# Altium project NewBrightCo_2015_Corvette.PrjPcb
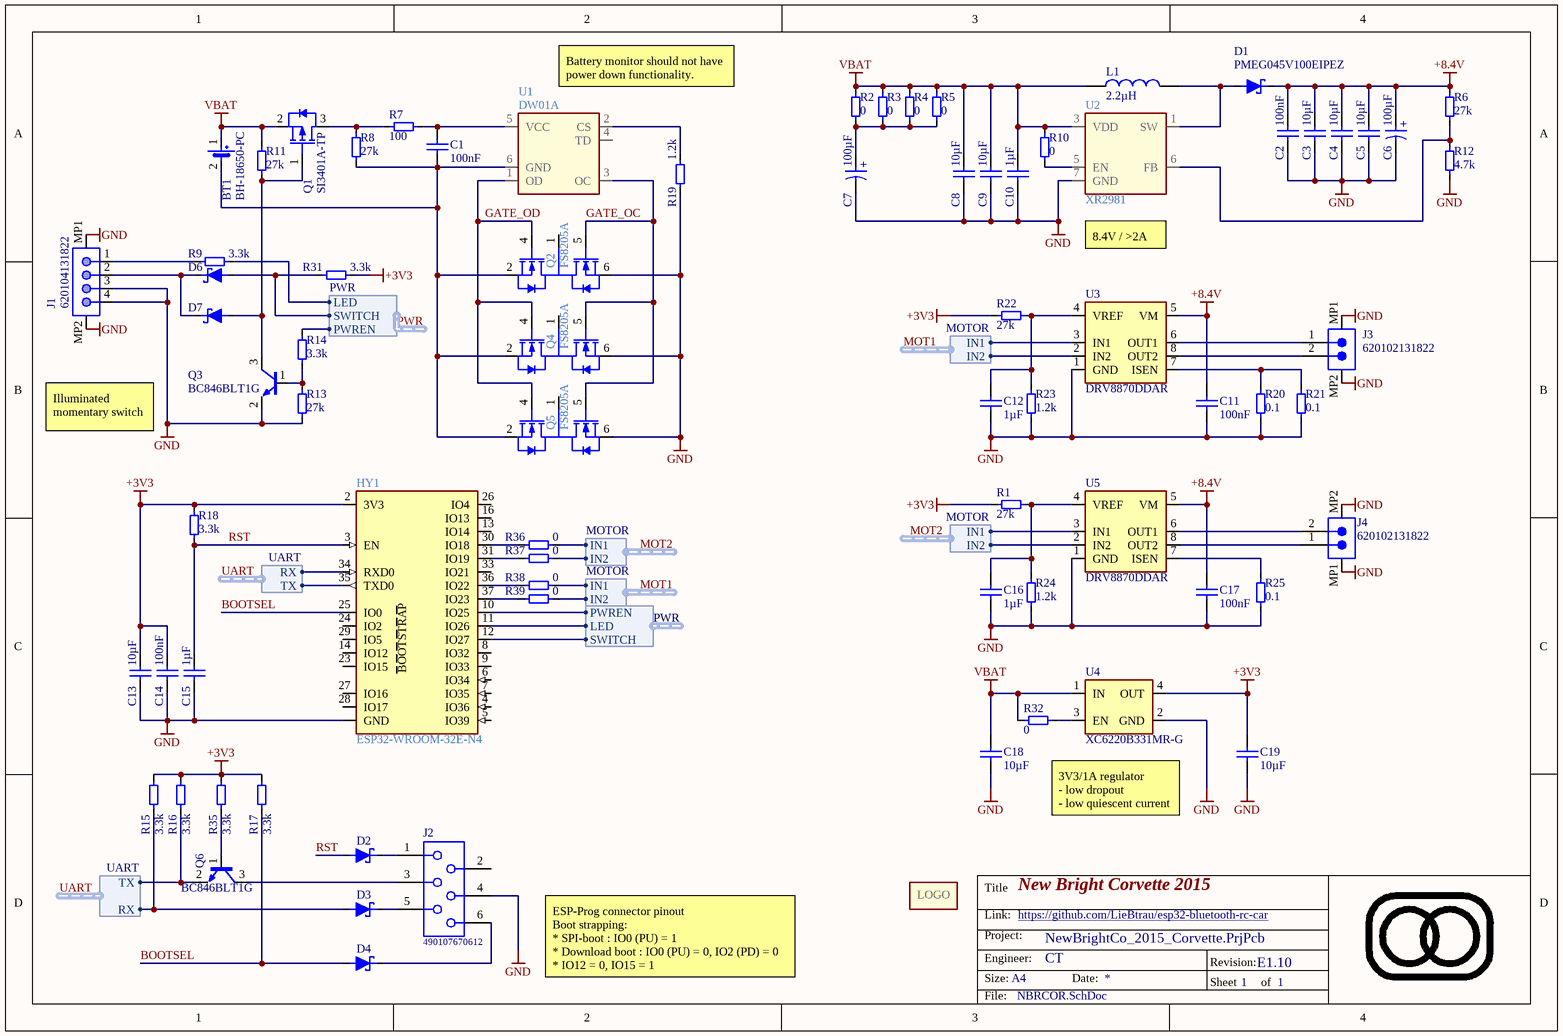
[diagram p0: NBRCOR.SchDoc]
board_name: NBRCOR; Project_link: https://github.com/LieBtrau/esp32-bluetooth-rc-car; project_revision: E1.10
1 sheet, 76 parts. Net scope: global (net labels, ports and power ports of the same name join across sheets).
Board file: NBRCOR.PcbDoc

## Sheet NBRCOR.SchDoc: New Bright Corvette 2015
size A4; Engineer: CT; SheetNumber: 1; SheetTotal: 1; SPICEModelCacheMNSAWVXE: <root> / <DocumentId>MNSAWVXE</DocumentId> / <CacheFrame Number="0"> / <Model Name="1090_7443330220_2.2u" Kind="CKT"> / <Text>******* / .subckt 1090_7443330220_2.2u 1 2 / Rp 1 2 1784 / Cp 1 2 1.727p / Rs 1 N3 0.0046 / L1 N3 2 1.945u / .ends 1090_7443330220_2.2u</Text> / </Model> / </CacheFrame> / </root>

### Parts
BT1  BH-18650-PC  [BH-18650-PC-Footprint-1]
C1  value 100nF  [0603-C-L]  (hidden comment: Capacitor 100nF +/-10% 25V X7R 0603)
C2  value 100nF  [0603-C-L]  (hidden comment: Capacitor 100nF +/-10% 25V X7R 0603)
C3  value 10µF  [0805-C-N]  (hidden comment: Capacitor 10µF +/-10% 10V X7R 0805)
C4  value 10µF  [0805-C-N]  (hidden comment: Capacitor 10µF +/-10% 10V X7R 0805)
C5  value 10µF  [0805-C-N]  (hidden comment: Capacitor 10µF +/-10% 10V X7R 0805)
C6  Capacitance: 100µF  [WCAP-PTG5_D8H11.5]  (hidden comment: 870025374001)
C7  Capacitance: 100µF  [WCAP-PTG5_D8H11.5]  (hidden comment: 870025374001)
C8  value 10µF  [0805-C-N]  (hidden comment: Capacitor 10µF +/-10% 10V X7R 0805)
C9  value 10µF  [0805-C-N]  (hidden comment: Capacitor 10µF +/-10% 10V X7R 0805)
C10  value 1µF  [0805-C-N]  (hidden comment: Capacitor 1µF +/-10% 10V X7R 0805)
C11  value 100nF  [0603-C-L]  (hidden comment: Capacitor 100nF +/-10% 25V X7R 0603)
C12  value 1µF  [0805-C-N]  (hidden comment: Capacitor 1µF +/-10% 10V X7R 0805)
C13  value 10µF  [0805-C-N]  (hidden comment: Capacitor 10µF +/-10% 10V X7R 0805)
C14  value 100nF  [0603-C-L]  (hidden comment: Capacitor 100nF +/-10% 25V X7R 0603)
C15  value 1µF  [0805-C-N]  (hidden comment: Capacitor 1µF +/-10% 10V X7R 0805)
C16  value 1µF  [0805-C-N]  (hidden comment: Capacitor 1µF +/-10% 10V X7R 0805)
C17  value 100nF  [0603-C-L]  (hidden comment: Capacitor 100nF +/-10% 25V X7R 0603)
C18  value 10µF  [0805-C-N]  (hidden comment: Capacitor 10µF +/-10% 10V X7R 0805)
C19  value 10µF  [0805-C-N]  (hidden comment: Capacitor 10µF +/-10% 10V X7R 0805)
D1  PMEG045V100EIPEZ  [TO-277]
D2  1PS79SB30,115  [FP-SOD523-MFG]  (value not drawn)
D3  1PS79SB30,115  [FP-SOD523-MFG]  (value not drawn)
D4  1PS79SB30,115  [FP-SOD523-MFG]  (value not drawn)
D6  1PS79SB30,115  [FP-SOD523-MFG]  (value not drawn)
D7  1PS79SB30,115  [FP-SOD523-MFG]  (value not drawn)
HY1  ESP32-WROOM-32E-N4  [FP-ESP32-WROOM-32E_4MB-MFG]
J1  620104131822  [620104131822]
J2  490107670612  [490107670612_Debugging Application]  (no BOM)
J3  620102131822  [620102131822]
J4  620102131822  [620102131822]
L1  Inductance: 2.2µH  [WE-HCC_1090]  (hidden comment: 7443330220)
M1  Logo  [LOGO_9x6mm]  (value not drawn)  (no BOM)
Q1  SI3401A-TP  [SOT-23-3-N]
Q2  FS8205A  [TSSOP8]
Q3  BC846BLT1G  [SOT-23-3-N]
Q4  FS8205A  [TSSOP8]
Q5  FS8205A  [TSSOP8]
Q6  BC846BLT1G  [SOT-23-3-N]
R1  value 27k  [0603-R-N]  (hidden comment: Resistor 27K +/-1% 0.1W 0603)
R2  value 0  [0603-R-N]  (hidden comment: Jumper 0R <50 mOhm 1A 0603)
R3  value 0  [0603-R-N]  (hidden comment: Jumper 0R <50 mOhm 1A 0603)
R4  value 0  [0603-R-N]  (hidden comment: Jumper 0R <50 mOhm 1A 0603)
R5  value 0  [0603-R-N]  (hidden comment: Jumper 0R <50 mOhm 1A 0603)
R6  value 27k  [0603-R-N]  (hidden comment: Resistor 27K +/-1% 0.1W 0603)
R7  value 100  [0603-R-N]  (hidden comment: Resistor 100R +/-1% 50V 0603)
R8  value 27k  [0603-R-N]  (hidden comment: Resistor 27K +/-1% 0.1W 0603)
R9  value 3.3k  [0603-R-N]  (hidden comment: Resistor 3.3k +/-1% 50V 0603)
R10  value 0  [0603-R-N]  (hidden comment: Jumper 0R <50 mOhm 1A 0603)
R11  value 27k  [0603-R-N]  (hidden comment: Resistor 27K +/-1% 0.1W 0603)
R12  value 4.7k  [0603-R-N]  (hidden comment: Resistor 4.7k +/-1% 50V 0603)
R13  value 27k  [0603-R-N]  (hidden comment: Resistor 27K +/-1% 0.1W 0603)
R14  value 3.3k  [0603-R-N]  (hidden comment: Resistor 3.3k +/-1% 50V 0603)
R15  value 3.3k  [0603-R-N]  (hidden comment: Resistor 3.3k +/-1% 50V 0603)
R16  value 3.3k  [0603-R-N]  (hidden comment: Resistor 3.3k +/-1% 50V 0603)
R17  value 3.3k  [0603-R-N]  (hidden comment: Resistor 3.3k +/-1% 50V 0603)
R18  value 3.3k  [0603-R-N]  (hidden comment: Resistor 3.3k +/-1% 50V 0603)
R19  value 1.2k  [0603-R-N]  (hidden comment: Resistor 1.2k +/-1% 50V 0603)
R20  value 0.1  [1206-R-N]  (hidden comment: CSR1206FKR100)
R21  value 0.1  [1206-R-N]  (hidden comment: CSR1206FKR100)
R22  value 27k  [0603-R-N]  (hidden comment: Resistor 27K +/-1% 0.1W 0603)
R23  value 1.2k  [0603-R-N]  (hidden comment: Resistor 1.2k +/-1% 50V 0603)
R24  value 1.2k  [0603-R-N]  (hidden comment: Resistor 1.2k +/-1% 50V 0603)
R25  value 0.1  [1206-R-N]  (hidden comment: CSR1206FKR100)
R31  value 3.3k  [0603-R-N]  (hidden comment: Resistor 3.3k +/-1% 50V 0603)
R32  value 0  [0603-R-N]  (hidden comment: Jumper 0R <50 mOhm 1A 0603)
R35  value 3.3k  [0603-R-N]  (hidden comment: Resistor 3.3k +/-1% 50V 0603)
R36  value 0  [0603-R-N]  (hidden comment: Jumper 0R <50 mOhm 1A 0603)
R37  value 0  [0603-R-N]  (hidden comment: Jumper 0R <50 mOhm 1A 0603)
R38  value 0  [0603-R-N]  (hidden comment: Jumper 0R <50 mOhm 1A 0603)
R39  value 0  [0603-R-N]  (hidden comment: Jumper 0R <50 mOhm 1A 0603)
U1  DW01A  [SOT-23-6]
U2  XR2981  [SOIC8_N_EP]
U3  DRV8870DDAR  [SOIC8_N_EP]
U4  XC6220B331MR-G  [SOT25-N]
U5  DRV8870DDAR  [SOIC8_N_EP]

### Harnesses
UART: RX, TX
MOTOR: IN1, IN2
PWR: LED, SWITCH, PWREN

### Nets
+3V3: C13.2 C14.2 C19.1 HY1.2(3V3) R1.2 R15.2 R16.2 R17.2 R18.2 R22.2 R31.1 R35.2 U4.4(OUT)
+8.4V: C2.1 C3.2 C4.2 C5.2 C6.1(P) C11.2 C17.2 D1.1(K) R6.2 U3.5(VM) U5.5(VM)
GND: C2.2 C3.1 C4.1 C5.1 C6.2(N) C7.2(N) C8.1 C9.1 C10.1 C11.1 C12.2 C13.1 C14.1 C15.1 C16.2 C17.1 C18.2 C19.2 HY1.1(GND) J1.3 J1.4 J1.MP1 J1.MP2 J2.4 J3.MP1 J3.MP2 J4.MP1 J4.MP2 Q2.6(S2) Q3.2(E) Q4.6(S2) Q5.6(S2) R12.1 R13.1 R19.1 R20.1 R21.1 R23.1 R24.1 R25.1 U2.7(GND) U3.1(GND) U4.2(GND) U5.1(GND)
VBAT: BT1.1(+) C8.2 C9.2 C10.2 C18.1 L1.1 Q1.2(SOURCE) R2.2 R3.2 R4.2 R5.2 R10.2 R11.2 R32.1 U2.3(VDD) U4.1(IN)
BOOTSEL: D4.2(A) HY1.25(IO0) R17.1
GATE_OC: Q2.5(G2) Q4.5(G2) Q5.5(G2) U1.3(OC)
GATE_OD: Q2.4(G1) Q4.4(G1) Q5.4(G1) U1.1(OD)
MOT1.IN1: R38.1 U3.3(IN1) ; harness MOTOR.IN1
MOT1.IN2: R39.1 U3.2(IN2) ; harness MOTOR.IN2
MOT2.IN1: R36.1 U5.3(IN1) ; harness MOTOR.IN1
MOT2.IN2: R37.1 U5.2(IN2) ; harness MOTOR.IN2
PWR.LED: HY1.11(IO26) R9.2 ; harness PWR.LED
PWR.PWREN: HY1.10(IO25) R14.2 ; harness PWR.PWREN
PWR.SWITCH: D6.2(A) HY1.12(IO27) R31.2 ; harness PWR.SWITCH
RST: C15.2 D2.2(A) HY1.3(EN) R18.1
UART.RX: D3.2(A) HY1.34(RXD0) R15.1 ; harness UART.RX
UART.TX: HY1.35(TXD0) Q6.2(E) R16.1 ; harness UART.TX
NetBT1_2: BT1.2(-) C1.2 Q2.2(S1) Q4.2(S1) Q5.2(S1) R8.2 U1.6(GND)
NetC1_1: C1.1 R7.2 U1.5(VCC)
NetC7_1: C7.1(P) R2.1 R3.1 R4.1 R5.1
NetC12_1: C12.1 R22.1 R23.2 U3.4(VREF)
NetC16_1: C16.1 R1.1 R24.2 U5.4(VREF)
NetD1_2: D1.2(A) L1.2 U2.1(SW)
NetD2_1: D2.1(K) J2.1
NetD3_1: D3.1(K) J2.5
NetD4_1: D4.1(K) J2.6
NetD6_1: D6.1(K) D7.1(K) J1.2
NetD7_2: D7.2(A) Q1.1(GATE) Q3.3(C) R11.1
NetHY1_30: HY1.30(IO18) R36.2
NetHY1_31: HY1.31(IO19) R37.2
NetHY1_36: HY1.36(IO22) R38.2
NetHY1_37: HY1.37(IO23) R39.2
NetJ1_1: J1.1 R9.1
NetJ2_3: J2.3 Q6.3(C)
NetJ3_1: J3.1 U3.6(OUT1)
NetJ3_2: J3.2 U3.8(OUT2)
NetJ4_1: J4.1 U5.8(OUT2)
NetJ4_2: J4.2 U5.6(OUT1)
NetQ1_3: Q1.3(DRAIN) R7.1 R8.1
NetQ3_1: Q3.1(B) R13.2 R14.1
NetQ6_1: Q6.1(B) R35.1
NetR6_1: R6.1 R12.2 U2.6(FB)
NetR10_1: R10.1 U2.5(EN)
NetR19_2: R19.2 U1.2(CS)
NetR20_2: R20.2 R21.2 U3.7(ISEN)
NetR25_2: R25.2 U5.7(ISEN)
NetR32_2: R32.2 U4.3(EN)

Not connected (* = marked no-connect by the designer): HY1 4(IO36) 5(IO39) 6(IO34) 7(IO35) 8(IO32) 9(IO33) 13(IO14) 14(IO12) 16(IO13) 23(IO15) 24(IO2) 26(IO4) 27(IO16) 28(IO17) 29(IO5) 33(IO21); J2 2; Q2 1(D12); Q4 1(D12); Q5 1(D12); U1 4(TD)

### Notes on the sheet
- (near U1) Battery monitor should not have power down functionality.
- (near U2) 8.4V / >2A
- Illuminated momentary switch
- 3V3/1A regulator
  - low dropout
  - low quiescent current
- ESP-Prog connector pinout
  Boot strapping:
  * SPI-boot : IO0 (PU) = 1
  * Download boot : IO0 (PU) = 0, IO2 (PD) = 0
  * IO12 = 0, IO15 = 1
- Title
- Link:
- Size:
- Project:
- Engineer:
- A4
- Date:
- Revision:
- Sheet
- of
- File:
- (in symbol CMP-00003-5) BOOTSTRAP
- (in symbol CMP-098-000013-3) +
- (in symbol Logo) LOGO

### Library data of the parts
BT1 = CMP-001-0034-6: Battery Holder 18650 Pc Pin; Number of Cells: 1; Termination: PC Pin; Min Operating Temperature: -40°C; Series: -; RoHS Compliant: Yes; Max Operating Temperature: 180°C; Mounting Technology: Through Hole,PCB; ComponentLink1Description: AliExpress alternative source; ComponentLink1URL: https://www.aliexpress.com/item/33037738446.html; JLCPCB Part #: C5383220
C1 C2 C11 C14 C17 = CMP-072-000592-12: WCAP-CSGP Multilayer Ceramic Chip Capacitor, General Purpose, size 0603, X7R, 100nF, 25VDC; Capacitor Type: MLCC; Tolerance: 10%; Dissipation Factor: 3.5%; Technical Reference: X7R0603104K025DFCT10000; Insulation Resistance: 5GO; Length: 1.6mm; Dielectric: X7R; Height: 0.8mm; Pins: 2; Min Operating Temperature: -55°C; Usage: General Purpose; Mounting Technology: SMT; Case/Package: 0603; Width: 0.8mm; Max Operating Temperature: 125°C; Voltage Rating: 25V; Design Item ID: 885012206071; ComponentLink1URL: https://www.we-online.com/redexpert/article/885012206071?ad; ComponentLink2URL: https://www.we-online.com/redexpert/spec/885012206071?ad; Packaging: Tape and Reel; ComponentLink1Description: Website Link; Match Code: WCAP-CSGP; ComponentLink2Description: Datasheet Link; Source: WCAP-CSGP.SchLib; JLCPCB Part #: C14663
C3-C5 C8 C9 C13 C18 C19 = CMP-072-000663-12: WCAP-CSGP Multilayer Ceramic Chip Capacitor, General Purpose, size 0805, X7R, 10µF, 10VDC; Technical Reference: X7R0805106K010DFCT10000; Tolerance: 10%; Capacitor Type: MLCC; Insulation Resistance: 0.01GO; Length: 2mm; ComponentLink2URL: https://www.we-online.com/redexpert/spec/885012207026?ad; Packaging: Tape and Reel; ComponentLink1Description: Website Link; Design Item ID: 885012207026; Source: WCAP-CSGP.SchLib; ComponentLink2Description: Datasheet Link; Pins: 2; Usage: General Purpose; Voltage Rating: 10V; Height: 1.25mm; ComponentLink1URL: https://www.we-online.com/redexpert/article/885012207026?ad; Dielectric: X7R; Mounting Technology: SMT; Dissipation Factor: 10%; Min Operating Temperature: -55°C; Width: 1.25mm; Max Operating Temperature: 125°C; Case/Package: 0805; Match Code: WCAP-CSGP; JLCPCB Part #: C15850
C6 C7 = CMP-098-000013-3: WCAP-PTG5 Aluminum Polymer Capacitor, Radial THT, D8 x H11.5mm, 100µF, 16V; Manufacturer: Wurth Elektronik; Leakage Current: 160µA; Capacitance Tolerance: +/-20%; Dissipation Factor: 8%; ESR: 12mO; Ripple Current: 4800mA; Technical Reference: PTEE115101M016DSPA7B000; Endurance: 2000h; ComponentLink1URL: https://www.we-online.com/redexpert/article/870025374001?ad; ComponentLink2URL: https://www.we-online.com/redexpert/spec/870025374001?ad; Mount: Through Hole; Height: 11.5mm; Diameter: 8mm; Pin Count: 2; Manufacturer Part Number: 870025374001; ComponentLink1Description: Website Link; Design Item ID: 870025374001; Operating Temperature Min: -55°C; Packaging: Ammo Pack; Component Type: Standard; Rated Voltage (DC): 16V; Operating Temperature Max: 105°C; Match Code: WCAP-PTG5; Category: Aluminum Polymer Capacitors; ComponentLink2Description: Datasheet Link; Source: WCAP-PTG5.SchLib
C10 C12 C15 C16 = CMP-072-000659-13: WCAP-CSGP Multilayer Ceramic Chip Capacitor, General Purpose, size 0805, X7R, 1µF, 10VDC; Dissipation Factor: 5%; Technical Reference: X7R0805105K010DFCT10000; Tolerance: 10%; Capacitor Type: MLCC; Insulation Resistance: 0.5GO; Source: WCAP-CSGP.SchLib; Usage: General Purpose; JLCPCB Part #: C28323; Width: 1.25mm; Mounting Technology: SMT; ComponentLink1URL: https://www.we-online.com/redexpert/article/885012207022?ad; Max Operating Temperature: 125°C; ComponentLink2Description: Datasheet Link; Min Operating Temperature: -55°C; Match Code: WCAP-CSGP; Case/Package: 0805; ComponentLink2URL: https://www.we-online.com/redexpert/spec/885012207022?ad; Voltage Rating: 10V; ComponentLink1Description: Website Link; Length: 2mm; Height: 1.25mm; Pins: 2; Dielectric: X7R; Packaging: Tape and Reel; Design Item ID: 885012207022
D1 = CMP-004-00051-4: Schottky Rectifier, 45V, 10A, Sot-1289 Rohs Compliant: Yes; Forward Voltage: 540 mV @ 10 A; Forward Current: 10A; Case/Package: TO-277, 3-PowerFDN, SOT1289B; Max Reverse Voltage (DC): 45V; JLCPCB Part #: C552777
D2-D4 D6 D7 = CMP-004-00048-5: VR=40V IF=200mA 20pF; Forward Voltage: 600 mV @ 200 mA; Forward Current: 200mA; Max Repetitive Reverse Voltage (Vrrm): 40V; Case/Package: SOD-523; RoHS Compliant: Yes; JLCPCB Part #: C426690
HY1 = CMP-00003-5: WiFi-Modul 802.11/BT 2, 4-2, 5GHz 150Mb/s; pin to pad: 1>1+15+38+39.1+39.2+39.3+39.4+39.5+39.6+39.7+39.8+39.9; JLCPCB Part #: C701341
J1 = CMP-047-000042-4: WR-WTB SMT Male Horizontal Shrouded Header, pitch 2mm, 4p; Withstanding Voltage: 800VAC; Contact Resistance: 20mOhm; Pin Number: 4; Working Voltage: 100VAC; Rated Current: 2A; Part Number: 620104131822; Operating Temperature: -25 to +85degC; Publisher: Wurth Elektronik; ComponentLink2URL: https://www.we-online.com/catalog/datasheet/620104131822.pdf; Gender: Male; Published Date: January 2020; Pitch: 2mm; Design Item ID: 620104131822; Component Type: Standard; Pin Count: 4; Type: Horizontal; Packaging: Tape and Reel; ComponentLink1Description: Manufacturer; Source: WR-WTB_2.00mm.SchLib; ComponentLink2Description: Datasheet; Mounting Technology: SMT; ComponentLink1URL: http://www.we-online.de; JLCPCB Part #: C265102
J2 = CMP-002-000028-7: WR-WST REDFIT IDC SKEDD, pitch 2.54mm, 6pins; Contact Resistance max.: 10mOhm; Gender: Transition; Rated Current: 1A; Pin Number: 6; Working Voltage: 100V(AC); Connector Type: Cable,IDC; Design Item ID: 490107670612; Source: WR-WST.SchLib; Packaging: Tube; ComponentLink2Description: Datasheet; Part Number: 490107670612; ComponentLink1Description: Manufacturer; Operating Temperature: -25 to +105degC; Pitch: 2.54mm; ComponentLink1URL: http://www.we-online.de; Published Date: November 2019; Mounting Technology: Press-In; Publisher: Wurth Elektronik; ComponentLink2URL: https://katalog.we-online.com/em/datasheet/490107670612.pdf; RoHS Compliant: Yes; Contact Plating: Gold; Series: REDFIT WR-WST
J3 J4 = CMP-047-000040-10: WR-WTB SMT Male Horizontal Shrouded Header, pitch 2mm, 2p; Rated Current: 2A; Withstanding Voltage: 800VAC; Pin Number: 2; Contact Resistance: 20mOhm; Working Voltage: 100VAC; Part Number: 620102131822; Published Date: January 2020; Pitch: 2mm; Component Type: Standard; Publisher: Wurth Elektronik; Operating Temperature: -25 to +85degC; Design Item ID: 620102131822; Pin Count: 2; Source: WR-WTB_2.00mm.SchLib; ComponentLink2URL: https://www.we-online.com/catalog/datasheet/620102131822.pdf; ComponentLink1Description: Manufacturer; ComponentLink2Description: Datasheet; Mounting Technology: SMT; Type: Horizontal; Packaging: Tape and Reel; ComponentLink1URL: http://www.we-online.de; Gender: Male; JLCPCB Part #: C295747
L1 = CMP-102-000031-2: WE-HCC SMT High Current Cube Inductor, size 1090, 2.2µH, 16.5A, 4.8mO; Manufacturer: Wurth Elektronik; Self Resonant Frequency: 80MHz; Case/Size Code: 1090; DC Resistance: 4.6mO; Saturation Current: 25.6A; Rated Inductance: 2.1µH; Material: Ferrite; DC Resistance Max: 4.8mO; Operating Temperature Max: 125°C; Component Type: Standard; Mount: Surface Mount; Height: 9.3mm; ComponentLink2URL: https://www.we-online.com/redexpert/spec/7443330220?ad; Category: Shielded Power Inductors; Pin Count: 2; Width: 10mm; Rated Current: 16.5A; ComponentLink2Description: Datasheet Link; Packaging: Tape and Reel; Operating Temperature Min: -40°C; Design Item ID: 7443330220; Length: 10.9mm; Match Code: WE-HCC; ComponentLink1URL: https://www.we-online.com/redexpert/article/7443330220?ad; Manufacturer Part Number: 7443330220; ComponentLink1Description: Website Link; Source: WE-HCC.SchLib
Q1 = CMP-013-00056-6: Trans Mosfet P-ch 30V 4.2A 3-PIN SOT-23 T/r; Rds On Max: 60mR; Max Power Dissipation: 400mW; Transistor Type: PMOS; Input Capacitance: 1.05nF; Vgs(th) (Max) @ Id: -1.3V @ 250µA; Mounting Technology: Surface Mount; Packaging: Cut Tape; Min Operating Temperature: -55°C; Id - Continuous Drain Current: 4.2A; Max Operating Temperature: 150°C; RoHS Compliant: Yes; Vds Max: 30V; Case/Package: SOT-23-3; JLCPCB Part #: C194253; Series: -
Q2 Q4 Q5 = CMP-013-00060-4: Dual common drain NFET for Li-Ion protection; pin to pad: 1>1+8 2>2+3 6>6+7; JLCPCB Part #: C16052
Q3 Q6 = CMP-013-00048-11: NPN Ic=100mA Vceo=65V hfe=200~450 P=225mW SOT-23; Ic Max: 100mA; Vce Max: 65V; Case/Package: SOT-23-3; Transistor Type: NPN; JLCPCB Part #: C82477
R1 R6 R8 R11 R13 R22 = CMP-009-00275-9: Res Thick Film 0603 27K Ohm 1% 0.1W(1/10W) ±100ppm/C Pad SMD Automotive T/R; Max Power Dissipation: 100mW; Usage: General Purpose; Tolerance: 1%; JLCPCB Part #: C22967; Case/Package: 0603
R2-R5 R10 R32 R36-R39 = CMP-009-00006-21: Chip Jumper, Thick Film, Jumper, 0603, 100mW, 1A, 0 Ohm, <50 mOhm; Elements: 1; Tolerance: 50 mOhm; Voltage Rating: 75V; Pins: 2; Usage: Jumper; Min Operating Temperature: -55°C; RoHS Compliant: True; JLCPCB Part #: C21189; Case/Package: 0603; Max Operating Temperature: 155°C; Resistor Type: Thick Film; Power Rating: 100mW; Mounting Technology: SMT; Current Rating: 1A
R7 = CMP-009-00232-13: Chip Resistor, Thick Film, General Purpose, 0603, 63mW, 50V, 100 Ohm, +/-1%; Temperature Coefficient: 100ppm/°C; Tolerance: 1%; Elements: 1; Resistor Type: Thick Film; Usage: General Purpose; Min Operating Temperature: -55°C; Max Operating Temperature: 155°C; JLCPCB Part #: C22775; Mounting Technology: SMT; RoHS Compliant: Yes; Power Rating: 63mW; Voltage Rating: 50V; Pins: 2; Case/Package: 0603
R9 R14-R18 R31 R35 = CMP-009-00243-13: Chip Resistor, Thick Film, General Purpose, 0603, 100mW, 50V, 3.3 kOhm, +/-1%; Tolerance: 1%; Elements: 1; Resistor Type: Thick Film; RoHS Compliant: Yes; Voltage Rating: 50V; Usage: General Purpose; Case/Package: 0603; Pins: 2; Power Rating: 100mW; Mounting Technology: SMT; Min Operating Temperature: -55°C; JLCPCB Part #: C22978; Max Operating Temperature: 155°C
R12 = CMP-009-00031-22: Chip Resistor, Thick Film, General Purpose, 0603, 100mW, 50V, 4.7 kOhm, +/-1%; Tolerance: 1%; Elements: 1; Power Rating: 100mW; JLCPCB Part #: C23162; RoHS Compliant: True; Max Operating Temperature: 155°C; Case/Package: 0603; Min Operating Temperature: -55°C; Resistor Type: Thick Film; Usage: General Purpose; Voltage Rating: 50V; Pins: 2; Mounting Technology: SMT
R19 R23 R24 = CMP-009-00244-13: Chip Resistor, Thick Film, General Purpose, 0603, 100mW, 50V, 1.2 kOhm, +/-1%; Tolerance: 1%; Elements: 1; Resistor Type: Thick Film; RoHS Compliant: Yes; Voltage Rating: 50V; Usage: General Purpose; Case/Package: 0603; Pins: 2; Power Rating: 100mW; Mounting Technology: SMT; Min Operating Temperature: -55°C; JLCPCB Part #: C22765; Max Operating Temperature: 155°C
R20 R21 R25 = CMP-009-00286-3: Res Thick Film 1206 0.1 Ohm 1% 1/2W ±100ppm/°C Molded SMD SMD Paper T/R; Power Rating: 500mW; Resistor Type: Thick Film; Radiation Hardening: No; Number of Terminations: 2; Packaging: Tape and Reel; RoHS Compliant: Yes; Mounting Technology: Surface Mount; Height: 0.026inch; Case Code (Imperial): 1206; Max Power Dissipation: 500mW; Tolerance: 1%; Lead Free: Lead Free; Series: CSR; Temperature Coefficient: 100ppm/°C; Construction: Rectangular; Military Standard: Not; Length: 0.12inch; Case/Package: 1206; Case Code (Metric): 3216; Contact Plating: Tin,Matte; Width: 0.061inch; Min Operating Temperature: -55°C; Max Operating Temperature: 155°C; Depth: 1.55mm; JLCPCB Part #: C346763
U1 = CMP-019-00088-5: Li-Ion protection IC; Over discharge protection: 2.4V; JLCPCB Part #: C351410
U2 = CMP-002-001560-3: 3.3V~5V Input 24W Output Step-up DC/DC Converter; pin to pad: 1>1+2 3>3+4 7>7+8+9
U3 U5 = CMP-001-0040-3: IC DRIVER DC MOTOR 3.6A 8SOIC; pin to pad: 1>1+9; Number of Outputs: 2; Operating Supply Current: 3mA; Interface: PWM; Operating Frequency: 100 kHz; Operating Supply Voltage: 45V; Mounting Technology: Surface Mount; Lead Free: Lead Free; JLCPCB Part #: C86590; Output Current: 3.6A; Package Quantity: 2500; Series: -; Max Operating Temperature: 125°C; Packaging: Cut Tape; Min Operating Temperature: -40°C; Technology: NMOS; Weight: 0.003457oz; Pins: 8; RoHS Compliant: Yes
U4 = CMP-019-00081-9: Fixed LDO 3.3V, 1%, 1A, Iq 108uA, -40°C to 85°C; pin to pad: 4>5; Max Input Voltage: 6V; Min Input Voltage: 4V; Number of Outputs: 1; Output Current: 1A; Case/Package: SOT-23-5; Output Voltage: 3.3V; JLCPCB Part #: C86534; Max Operating Temperature: 85°C; Output Type: Fixed; Quiescent Current: 108uA; Mount: SMT; Number of Regulators: 1; Min Operating Temperature: -40°C; Accuracy: 1%

## Assembly variants
A: not fitted R1 R8